# EAGLE design vc_board_v010 (EAGLE 9.5.2)
Wifi2Dmx Bridge WeMos D1 mini MAX485 (SO8) Neutrik NC1FAH1 5050 RGB LED BESTELLT: 30.06.2020
DNAME: Ruemmler, Elias
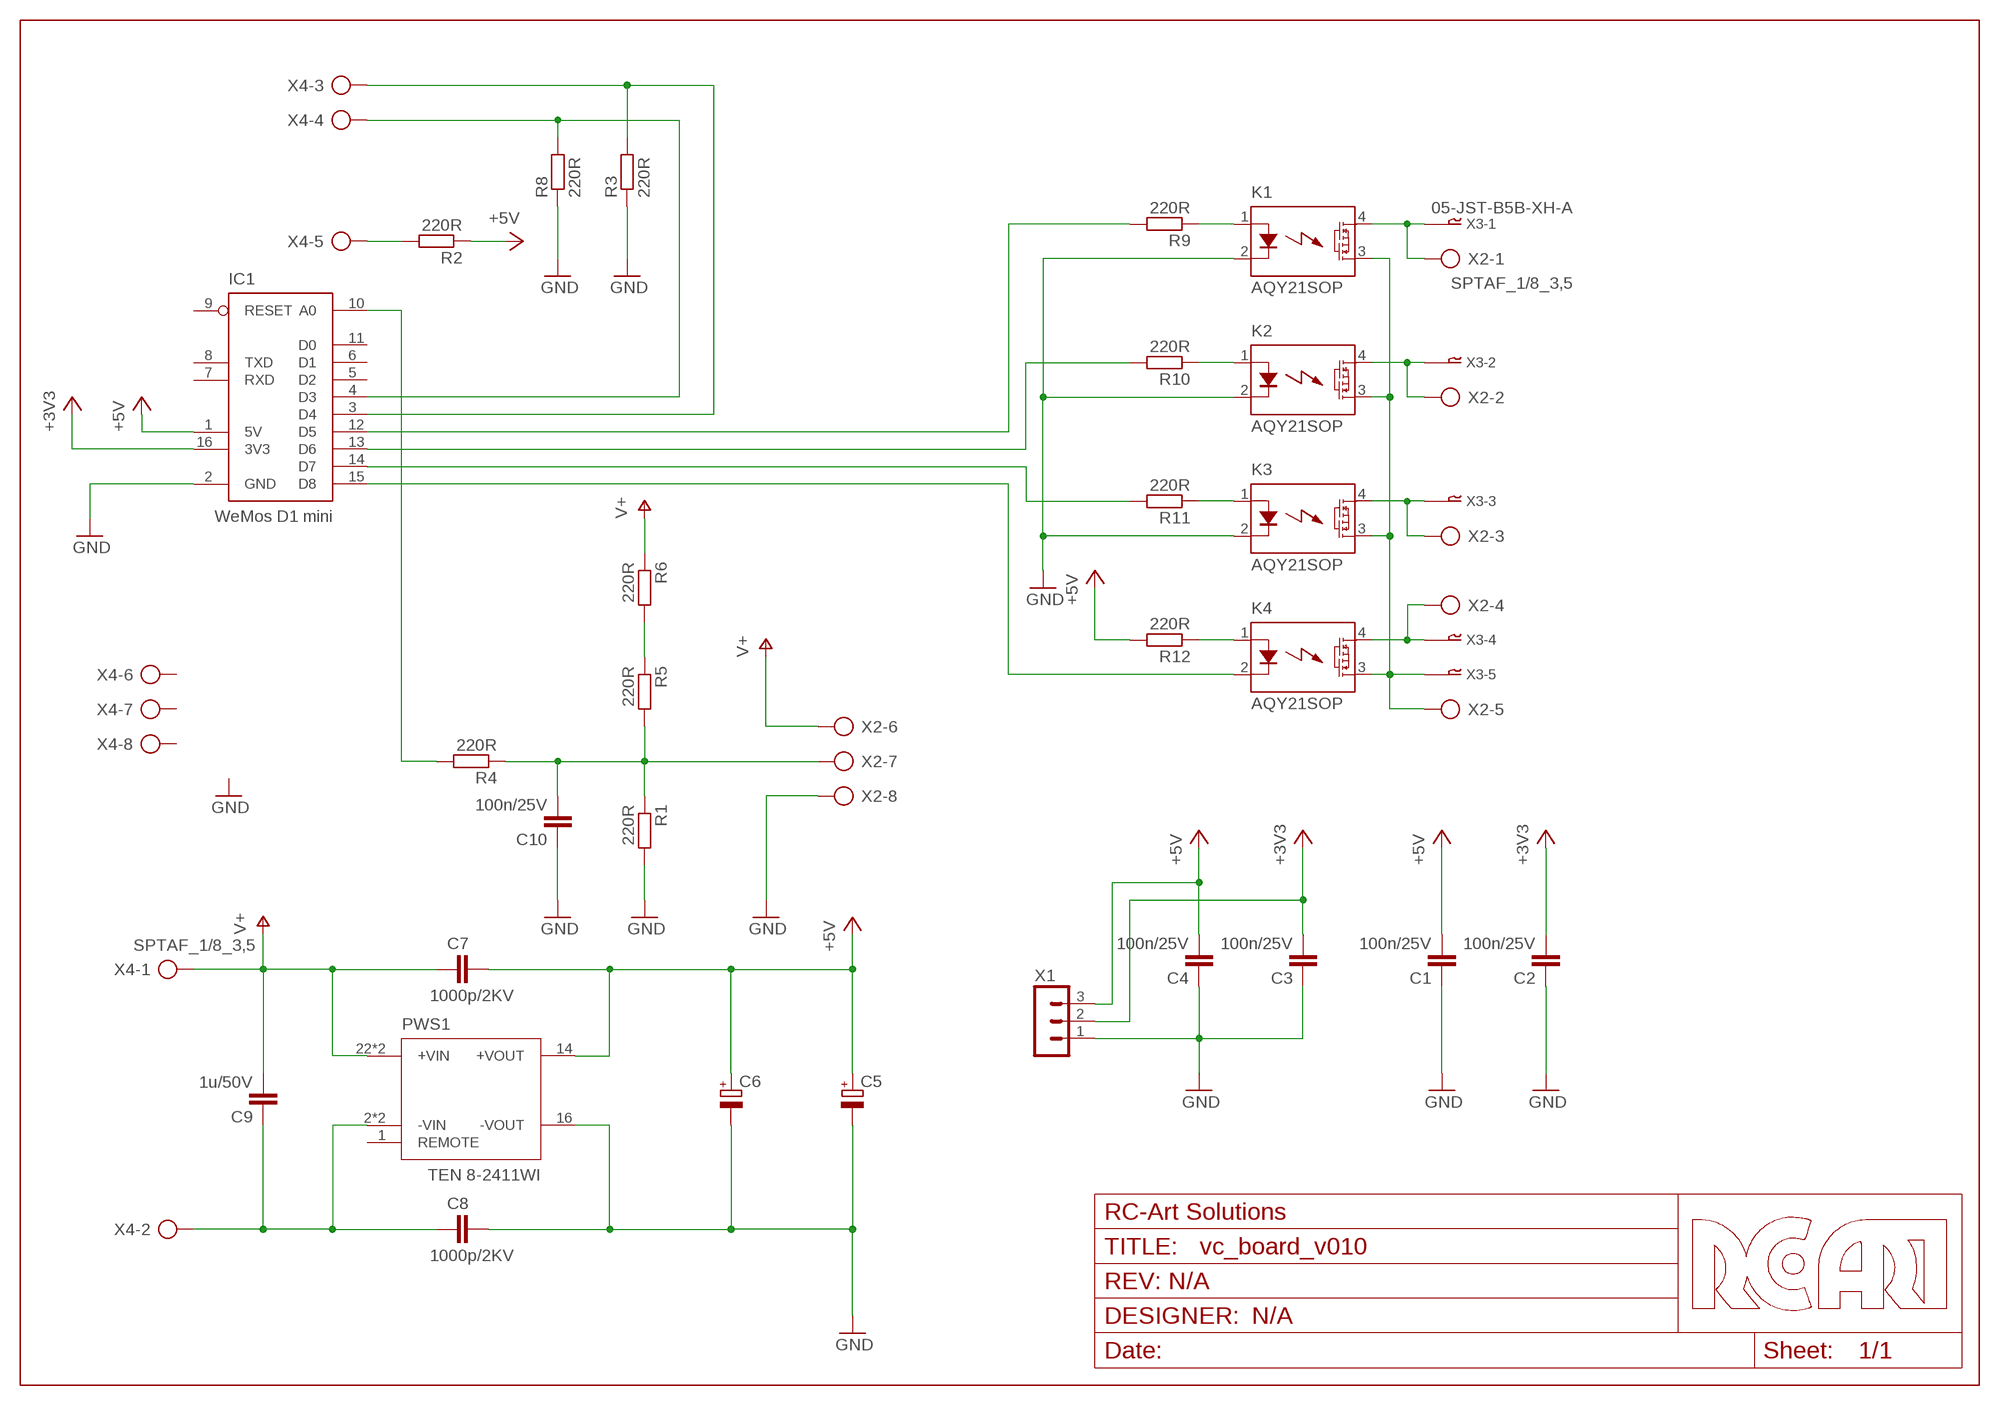
[diagram p0: schematic, sheet 1]

## Parts
C1  100n/25V  C-EUC0805  [C0805]
C2  100n/25V  C-EUC0805  [C0805]
C3  100n/25V  C-EUC0805  [C0805]
C4  100n/25V  C-EUC0805  [C0805]
C5  CPOL-EUCT7343  [CT7343]
C6  CPOL-EUCT7343  [CT7343]
C7  1000p/2KV  C-EUC1206K  [C1206K]
C8  1000p/2KV  C-EUC1206K  [C1206K]
C9  1u/50V  C-EUC1210K  [C1210K]
C10  100n/25V  C-EUC0805  [C0805]
FRAME1  MF_FRAMEDEFAULT  [MF_FRAME_DEFAULT]
IC1  WeMos D1 mini  D1_MINI  [D1_MINI]
K1  AQY21SOP  [SOP04]
K2  AQY21SOP  [SOP04]
K3  AQY21SOP  [SOP04]
K4  AQY21SOP  [SOP04]
PWS1  TEN 8-2411WI  TEN8WI  [TEN8]
R1  220R  R-EU_R0805  [R0805]
R2  220R  R-EU_R0805  [R0805]
R3  220R  R-EU_R0805  [R0805]
R4  220R  R-EU_R0805  [R0805]
R5  220R  R-EU_R0805  [R0805]
R6  220R  R-EU_R0805  [R0805]
R8  220R  R-EU_R0805  [R0805]
R9  220R  R-EU_R0805  [R0805]
R10  220R  R-EU_R0805  [R0805]
R11  220R  R-EU_R0805  [R0805]
R12  220R  R-EU_R0805  [R0805]
X1  MA03-1  [MA03-1]
X2  SPTAF_1/8_3,5  [SPTAF_1/8_3,5]
X3  05-JST-B5B-XH-A  [B5B-XH]
X4  SPTAF_1/8_3,5  [SPTAF_1/8_3,5]

## Nets
+3V3: C2.2 C3.2 IC1.16(3V3) X1.2
+5V: C1.2 C4.2 C5.+ C6.+ C7.2 IC1.1(5V) PWS1.14(+VOUT) R2.1 R12.2 X1.3
GND: C1.1 C2.1 C3.1 C4.1 C5.- C6.- C8.2 C10.1 IC1.2(GND) K1.2(K) K2.2(K) K3.2(K) PWS1.16(-VOUT) R1.2 R3.1 R8.1 X1.1 X2.8 X2.8A
N$1: C10.2 R1.1 R4.1 R5.2 X2.7 X2.7A
N$2: IC1.4(D3) R8.2 X4.4 X4.4A
N$3: IC1.3(D4) R3.2 X4.3 X4.3A
N$4: C8.1 C9.1 PWS1.2(-VIN) PWS1.3(-VIN) X4.2 X4.2A
N$5: R2.2 X4.5 X4.5A
N$6: K1.3(DS2) K2.3(DS2) K3.3(DS2) K4.3(DS2) X2.5 X2.5A X3.P$5
N$7: K4.4(DS1) X2.4 X2.4A X3.P$4
N$8: K3.4(DS1) X2.3 X2.3A X3.P$3
N$9: K2.4(DS1) X2.2 X2.2A X3.P$2
N$10: K1.4(DS1) X2.1 X2.1A X3.P$1
N$11: K4.1(A) R12.1
N$12: R5.1 R6.2
N$13: K3.1(A) R11.1
N$14: K2.1(A) R10.1
N$16: K1.1(A) R9.1
N$17: IC1.15(D8) K4.2(K)
N$18: IC1.14(D7) R11.2
N$19: IC1.13(D6) R10.2
N$20: IC1.12(D5) R9.2
N$21: IC1.10(A0) R4.2
V+: C7.1 C9.2 PWS1.22(+VIN) PWS1.23(+VIN) R6.1 X2.6 X2.6A X4.1 X4.1A
Unconnected: IC1.5(D2) IC1.6(D1) IC1.7(RXD) IC1.8(TXD) IC1.9(RESET) IC1.11(D0) PWS1.1(REMOTE) X4.6 X4.6A X4.7 X4.7A X4.8 X4.8A

## Library data of the parts
C1-C4 C7-C10 = rcl:C-EU: CAPACITOR, European symbol; SPICEPREFIX: C
C5 C6 = rcl:CPOL-EU: POLARIZED CAPACITOR, European symbol; SPICEPREFIX: C
FRAME1 = rca-frames:MF_FRAME: Library: MF_Aesthetics Description: Frame for adding Meta Data to the PCB and Schematic.; DNAME: N/A; HOUSEPART: 0; POPULATE: 0; REVNUM: REV: N/A
IC1 = rca-wemos:D1_MINI
K1-K4 = relay:AQY*: PhotoMOS Relay NAiS Source: http://www.panasonic-electric-works.com/catalogues/downloads/photomos/ds_x615_en_aqz10_20.pdf; OC_FARNELL: unknown; OC_NEWARK: unknown
PWS1 = dc-dc-traco:TEN8WI
R1-R6 R8-R12 = rcl:R-EU_: RESISTOR, European symbol; SPICEPREFIX: R
X1 = con-lstb:MA03-1: PIN HEADER; OC_FARNELL: unknown; OC_NEWARK: unknown
X2 X4 = con-phoenix-sptaf:SPTAF_1/8_3,5: Leiterplattenklemme - SPTAF 1/ 8-3,5-IL - 1861991 Leiterplattenklemme, Nennstrom: 16 A, Bemessungsspannung (III/2): 160 V, Nennquerschnitt: 1,5 mm², Anzahl der Potenziale: 8, Anzahl der Reihen: 1, Polzahl pro Reihe: 8, Artikelfamilie: SPTAF 1/..-IL, Rastermaß: 3,5 mm, Anschlussart: Push-in-Federanschluss, Montage: Wellenlöten, Anschlussrichtung Leiter/Platine: 45 °, Farbe: grün, Pin-Layout: Lineares Doppel-Pinning, Pinlänge [P]: 2,6 mm, Verpackungsart: verpackt im Karton; MF: FARNELL; MPN: 1861991; OC_FARNELL: 2580663; OC_NEWARK: 71C4133
X3 = con-jst-xh:05-JST: JST CONNECTOR

## Net classes
0 default: clearance 0.381 mm

## Board
Wifi2Dmx Bridge WeMos D1 mini MAX485 (SO8) Neutrik NC1FAH1 5050 RGB LED BESTELLT: 30.06.2020
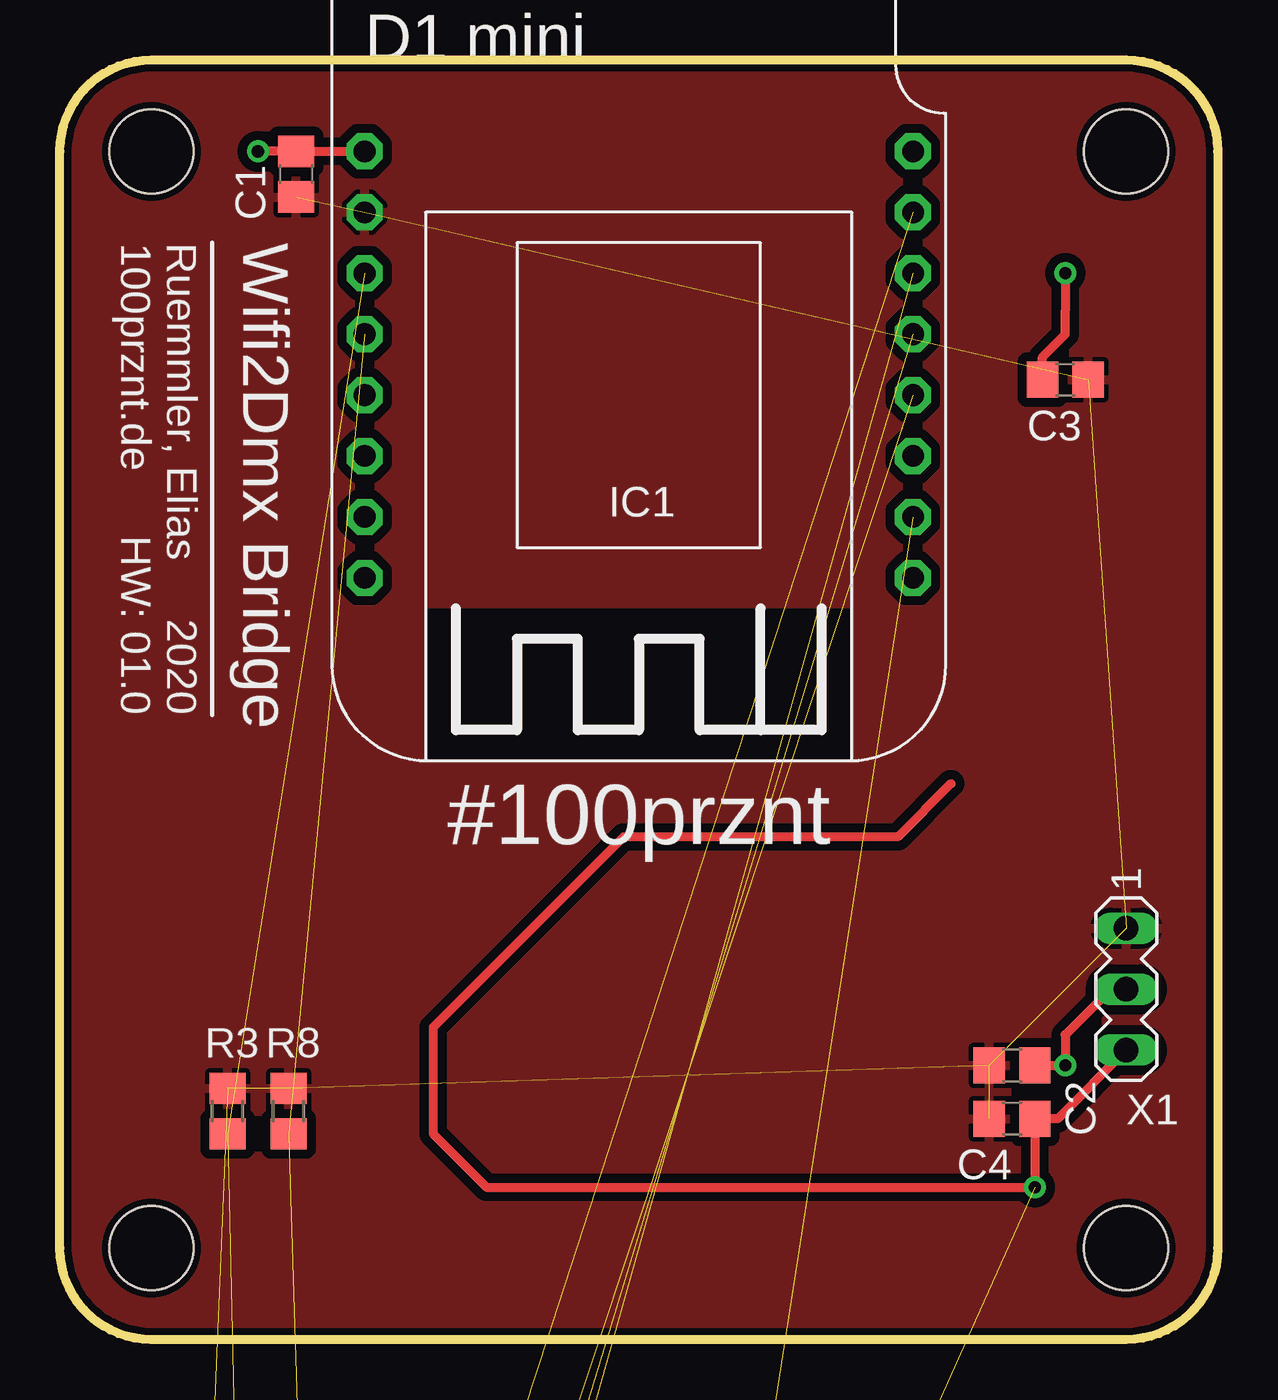
[diagram p1: board, top side]
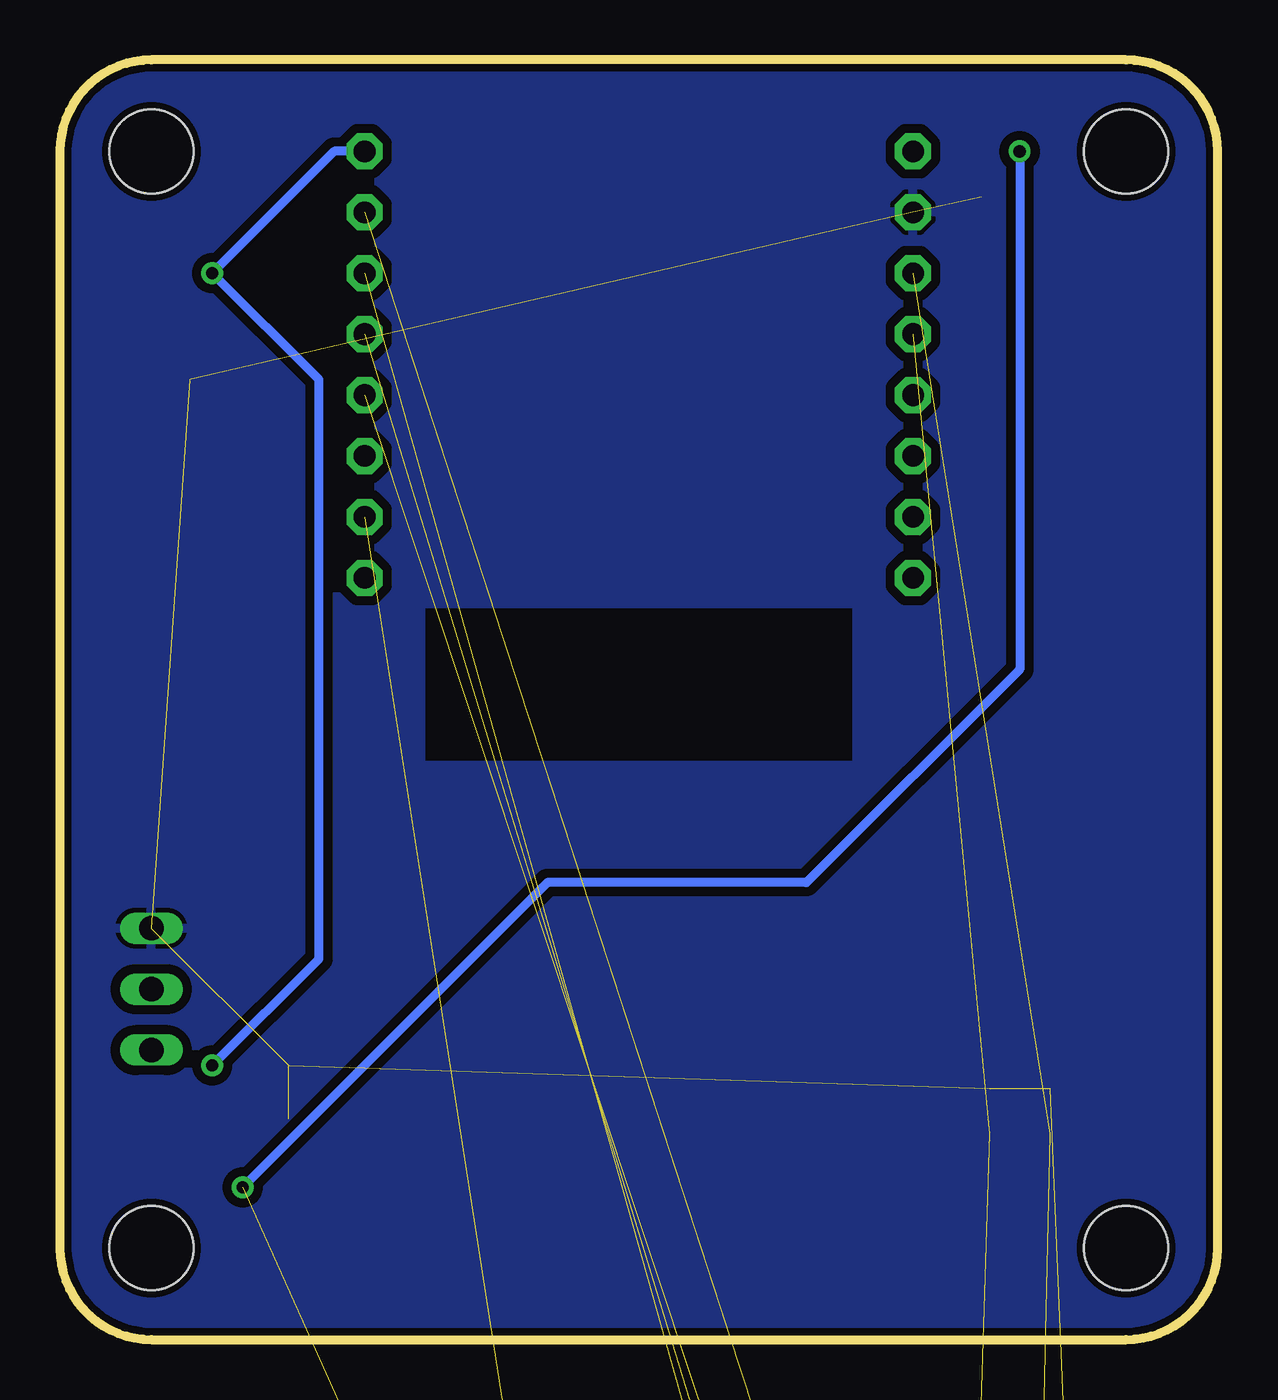
[diagram p2: board, bottom side, seen from below]

Size 48.26 x 53.34 mm. Coordinates in mm from the lower left corner, seen from the top.
Outline: 48.26,49.53 48.26,3.81 arc-90 44.45,0 3.81,0 arc-90 0,3.81 0,49.53 arc-90 3.81,53.34 44.45,53.34 arc-90 48.26,49.53
Copper layers (1*16): Top 0.035mm / dielectric 1.6mm / Bottom 0.035mm
Design rules "JLCPCB_doublelayer": minimum track width 5mil, minimum drill 0.3mm, track to track 5mil, track to pad 5mil, pad to pad 5mil, via to via 5mil, smd to smd 5mil, copper to edge 0.3mm, drill to drill 0.2mm, minimum pad ring 0.15mm, minimum via ring 0.15mm, stop-mask expansion 0.075mm, vias tented up to drill 0mil, thermal gap 0.2mm
Holes 3.5 mm at 3.81,49.53 44.45,49.53 44.45,3.81 3.81,3.81

### Footprints (pad centres in the part's own frame; a part is rotated, then mirrored left to right if it is on the bottom)
C0805 = smd 1.3 x 1.5: 1 -0.95,0; 2 0.95,0
CT7343 = smd 2.6 x 2.4: + -3.2,0; - 3.2,0
C1206K = smd 1.5 x 2: 1 -1.5,0; 2 1.5,0
C1210K = smd 1.5 x 2.9: 1 -1.5,0; 2 1.5,0
D1_MINI = drill 0.9 pad 1.5 octagon: 1 11.43,0; 2 11.43,2.54; 3 11.43,5.08; 4 11.43,7.62; 5 11.43,10.16; 6 11.43,12.7; 7 11.43,15.24; 8 11.43,17.78; 9 -11.43,17.78; 10 -11.43,15.24; 11 -11.43,12.7; 12 -11.43,10.16; 13 -11.43,7.62; 14 -11.43,5.08; 15 -11.43,2.54; 16 -11.43,0
SOP04 = smd 0.8 x 1.2: 1 -1.27,-3; 2 1.27,-3; 3 1.27,3; 4 -1.27,3
TEN8 = drill 0.7 octagon: 1 -13.97,-7.62; 2 -11.43,-7.62; 3 -8.89,-7.62; 9 6.35,-7.62; 11 11.43,-7.62; 14 11.43,7.62; 16 6.35,7.62; 22 -8.89,7.62; 23 -11.43,7.62
R0805 = smd 1.3 x 1.5: 1 -0.95,0; 2 0.95,0
MA03-1 = drill 1.016 long: 1 -2.54,0; 2 0,0; 3 2.54,0
SPTAF_1/8_3,5 = drill 1.2 pad 1.6 long: 1 0,0; 1A 0,-5; 2 3.5,0; 2A 3.5,-5; 3 7,0; 3A 7,-5; 4 10.5,0; 4A 10.5,-5; 5 14,0; 5A 14,-5; 6 17.5,0; 6A 17.5,-5; 7 21,0; 7A 21,-5; 8 24.5,0; 8A 24.5,-5
B5B-XH = drill 0.8 square: P$1 -5.08,0 | drill 0.8: P$2 -2.54,0; P$3 0,0; P$4 2.54,0; P$5 5.08,0

### Placement (x,y rotation side)
C1  9.84,48.58 90 top
C2  39.69,11.43 0 top
C3  41.91,40.01 180 top
C4  39.69,9.21 0 top
C5  5.08,-118.75 0 top  (outside the outline)
C6  5.08,-125.73 0 top  (outside the outline)
C7  2.54,-154.94 0 top  (outside the outline)
C8  2.54,-158.75 0 top  (outside the outline)
C9  2.54,-163.19 0 top  (outside the outline)
C10  1.9,-194.94 0 top  (outside the outline)
FRAME1  18.41,-6.98 0 top  (outside the outline)
IC1  24.13,49.53 180 top
K1  4.45,-17.14 0 top  (outside the outline)
K2  4.45,-25.4 0 top  (outside the outline)
K3  4.45,-33.66 0 top  (outside the outline)
K4  4.45,-41.91 0 top  (outside the outline)
PWS1  16.51,-141.6 0 top  (outside the outline)
R1  1.9,-169.55 0 top  (outside the outline)
R2  1.9,-201.3 0 top  (outside the outline)
R3  6.98,9.53 270 top
R4  1.9,-175.9 0 top  (outside the outline)
R5  1.9,-182.25 0 top  (outside the outline)
R6  1.9,-188.59 0 top  (outside the outline)
R8  9.52,9.53 270 top
R9  1.9,-59.06 0 top  (outside the outline)
R10  1.9,-65.41 0 top  (outside the outline)
R11  1.9,-71.75 0 top  (outside the outline)
R12  1.9,-78.11 0 top  (outside the outline)
X1  44.45,14.61 270 top
X2  2.54,-87 0 top  (outside the outline)
X3  7.62,-51.44 0 top  (outside the outline)
X4  2.54,-103.5 0 top  (outside the outline)

### Tracks (layer width: path | path; a pad name or v marks a point on that pad's centre or on a via)
+3V3  (via drill 0.51)
  Top 0.381: v41.91,44.45 41.91,42.87 41.91,41.91 40.96,40.96 C3.2 41.27,39.69 | X1.2 43.81,14.61 41.91,12.7 v41.91,11.43 C2.2
  Bottom 0.381: v41.91,11.43 37.47,15.88 37.47,40.01 v41.91,44.45 36.83,49.53 IC1.16
+5V  (via drill 0.51)  (6 unrouted)
  Top 0.381: v8.25,49.53 v8.26,49.53 C1.2 IC1.1 | 37.14,23.18 34.92,20.96 23.49,20.96 15.55,13.02 15.55,8.58 17.78,6.35 v40.64,6.35 C4.2 41.59,9.21 X1.3
  Bottom 0.381: v8.25,49.53 8.25,27.94 17.14,19.05 27.94,19.05 v40.64,6.35
GND  (18 unrouted)
  pour Top: 48.26,49.53 48.26,3.81 arc-90 44.45,0 3.81,0 arc-90 0,3.81 0,49.53 arc-90 3.81,53.34 44.45,53.34 arc-90
  pour Bottom: 3.81,0 44.45,0 arc90 48.26,3.81 48.26,49.53 arc90 44.45,53.34 3.81,53.34 arc90 0,49.53 0,3.81 arc90
N$1  (5 unrouted)
N$2  (3 unrouted)
N$3  (3 unrouted)
N$4  (5 unrouted)
N$5  (2 unrouted)
N$6  (6 unrouted)
N$7  (3 unrouted)
N$8  (3 unrouted)
N$9  (3 unrouted)
N$10  (3 unrouted)
N$11  (1 unrouted)
N$12  (1 unrouted)
N$13  (1 unrouted)
N$14  (1 unrouted)
N$16  (1 unrouted)
N$17  (1 unrouted)
N$18  (1 unrouted)
N$19  (1 unrouted)
N$20  (1 unrouted)
N$21  (1 unrouted)
V+  (8 unrouted)

### Text on the board
tPlace: Ruemmler, Elias / 100prznt.de | Wifi2Dmx Bridge | 2020 / HW: 01.0 | #100prznt